# EAGLE design TestBoard3 (EAGLE 9.6.2)

## Sheet 1 of 5
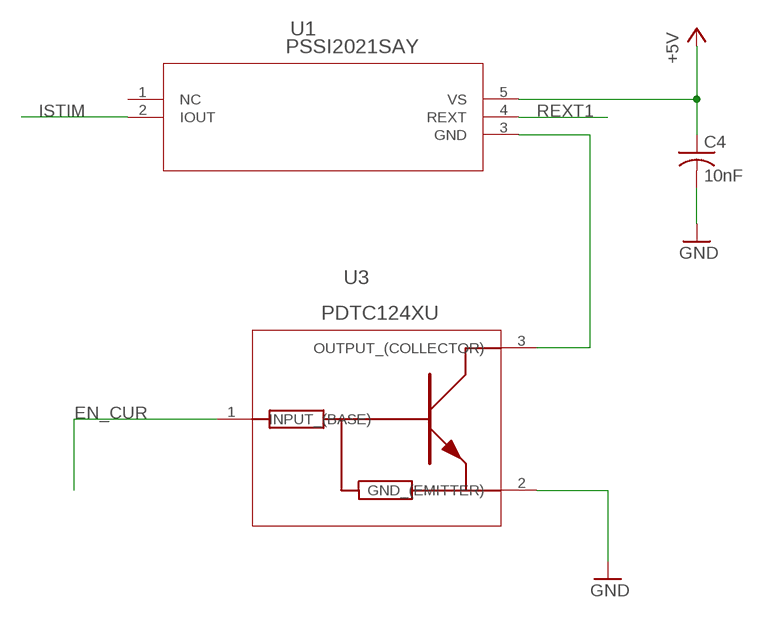
[diagram p0: schematic, sheet 1]

### Parts
C4  10nF  C-USC0603  [C0603]
U1  PSSI2021SAY  [SOT353_NXP]
U3  PDTC124XU  [SOT323_NXP]

### Nets
+5V: C4.1 U1.5(VS) ; also sheet 2,3,4
EN_CUR: U3.1(INPUT_(BASE)) ; also sheet 5
GND: C4.2 U3.2(GND_(EMITTER)) ; also sheet 2,3,4,5
ISTIM: U1.2(IOUT) ; also sheet 4
N$6: U1.3(GND) U3.3(OUTPUT_(COLLECTOR))
REXT1: U1.4(REXT) ; also sheet 3
Unconnected: U1.1(NC)

## Sheet 2 of 5: Voltage Boost Circuit
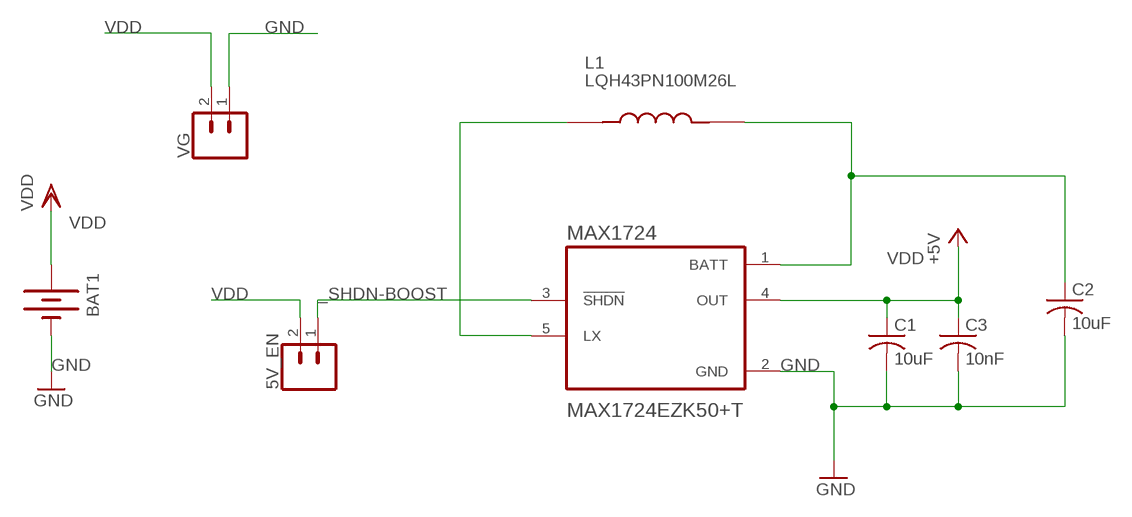
[diagram p1: schematic, sheet 2]

### Parts
5V_EN  CONN_02  [1X02]
BAT1  BATTERYBU2032SM  [BU2032SM]
C1  10uF  C-USC1206  [C1206]
C2  10uF  C-USC1206  [C1206]
C3  10nF  C-USC0603  [C0603]
L1  LQH43PN100M26L  [IND_LQH43PN100M26L]
MAX1724  MAX1724EZK50+T  [SOT95P275X110-5N]
VG  CONN_02  [1X02]

### Nets
+5V: C1.1 C3.1 MAX1724.4(OUT) ; also sheet 1,3,4
_SHDN-BOOST: 5V_EN.1 MAX1724.3(!SHDN) ; also sheet 5
GND: BAT1.P$2(-) C1.2 C2.2 C3.2 MAX1724.2(GND) VG.1 ; also sheet 1,3,4,5
N$7: L1.1 MAX1724.5(LX)
VDD: 5V_EN.2 BAT1.P$1(+) C2.1 L1.2 MAX1724.1(BATT) VG.2 ; also sheet 3,5

## Sheet 3 of 5: Digital Potentiometer
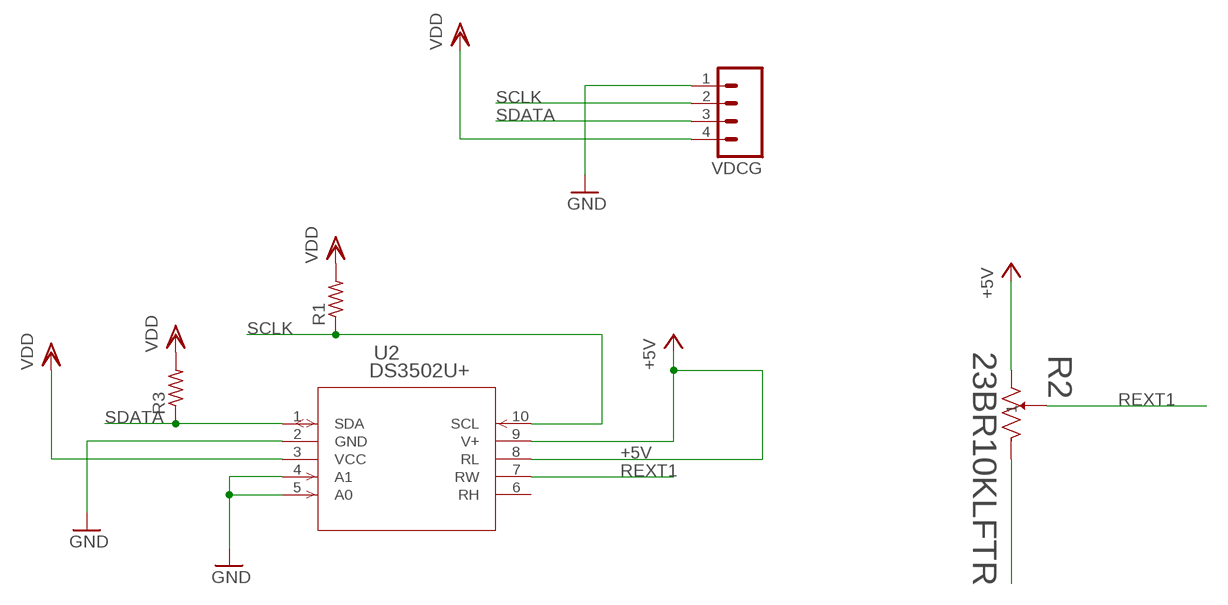
[diagram p2: schematic, sheet 3]

### Parts
R1  R-US_R0603  [R0603]
R2  23BR10KLFTR  [RES3_23B_TTE]
R3  R-US_R0603  [R0603]
U2  DS3502U+  [21-0061_U10+2_MXM]
VDCG  M04LOCK  [1X04_LOCK]

### Nets
+5V: R2.1 U2.8(RL) U2.9(V+) ; also sheet 1,2,4
GND: U2.2(GND) U2.4(A1) U2.5(A0) VDCG.1 ; also sheet 1,2,4,5
N$2: R2.3
REXT1: R2.2 U2.7(RW) ; also sheet 1
SCLK: R1.1 U2.10(SCL) VDCG.2 ; also sheet 5
SDATA: R3.1 U2.1(SDA) VDCG.3 ; also sheet 5
VDD: R1.2 R3.2 U2.3(VCC) VDCG.4 ; also sheet 2,5
Unconnected: U2.6(RH)

## Sheet 4 of 5: Electrode H-Bridge Multiplexer
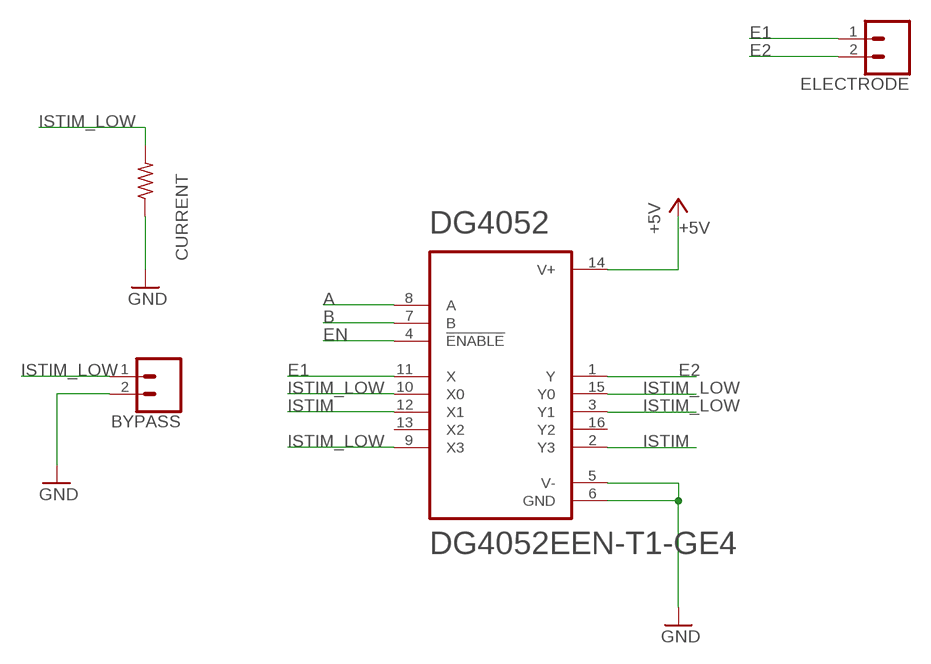
[diagram p3: schematic, sheet 4]

### Parts
BYPASS  CONN_02LOCK  [1X02_LOCK]
CURRENT  R-US_0204/7  [0204/7]
DG4052  DG4052EEN-T1-GE4  [QFN40P260X180X60-16N]
ELECTRODE  CONN_02  [1X02]

### Nets
+5V: DG4052.14(V+) ; also sheet 1,2,3
A: DG4052.8(A) ; also sheet 5
B: DG4052.7(B) ; also sheet 5
E1: DG4052.11(X) ELECTRODE.1
E2: DG4052.1(Y) ELECTRODE.2
EN: DG4052.4(!ENABLE) ; also sheet 5
GND: BYPASS.2 CURRENT.1 DG4052.5(V-) DG4052.6(GND) ; also sheet 1,2,3,5
ISTIM: DG4052.2(Y3) DG4052.12(X1) ; also sheet 1
ISTIM_LOW: BYPASS.1 CURRENT.2 DG4052.3(Y1) DG4052.9(X3) DG4052.10(X0) DG4052.15(Y0) ; also sheet 5
Unconnected: DG4052.13(X2) DG4052.16(Y2)

## Sheet 5 of 5: MSP430
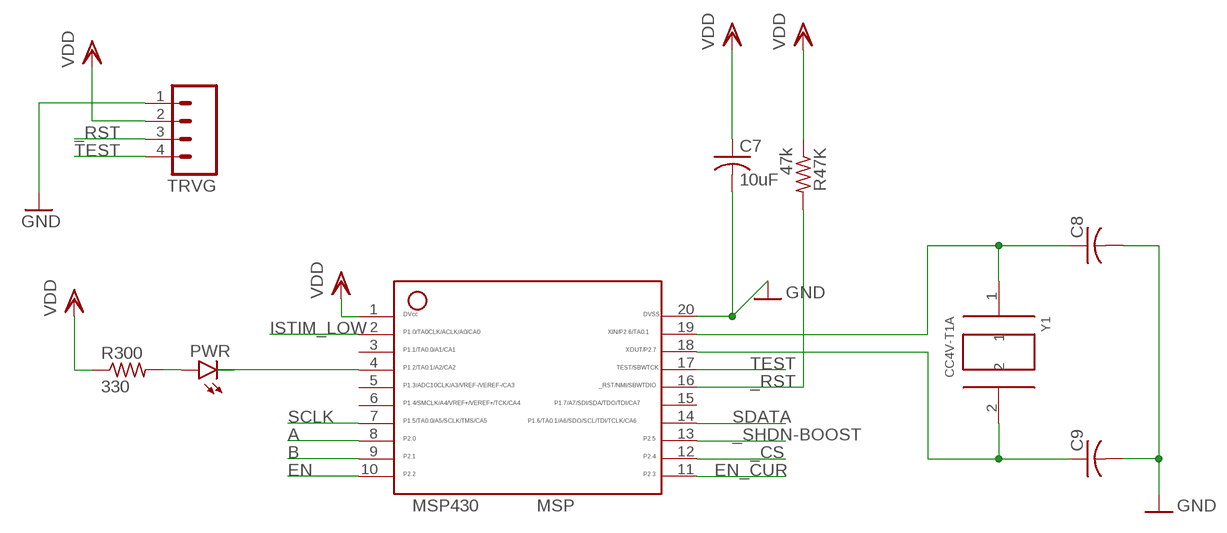
[diagram p4: schematic, sheet 5]

### Parts
C7  10uF  C-USC1206  [C1206]
C8  C-USC0603  [C0603]
C9  C-USC0603  [C0603]
MSP430  MSP  MSP430  [20_PIN]
PWR  LEDCHIPLED_0603  [CHIPLED_0603]
R47K  47k  R-US_R0603  [R0603]
R300  330  R-US_R0603  [R0603]
TRVG  M04LOCK  [1X04_LOCK]
Y1  CC4V-T1A  [CC4V-T1A]

### Nets
_CS: MSP430.12
_RST: MSP430.16 R47K.2 TRVG.3
_SHDN-BOOST: MSP430.13 ; also sheet 2
A: MSP430.8 ; also sheet 4
B: MSP430.9 ; also sheet 4
EN: MSP430.10 ; also sheet 4
EN_CUR: MSP430.11 ; also sheet 1
GND: C7.2 C8.2 C9.2 MSP430.20 TRVG.1 ; also sheet 1,2,3,4
ISTIM_LOW: MSP430.2 ; also sheet 4
N$10: MSP430.4 PWR.C
N$13: PWR.A R300.2
N$14: C8.1 MSP430.19 Y1.1
N$15: C9.1 MSP430.18 Y1.2
SCLK: MSP430.7 ; also sheet 3
SDATA: MSP430.14 ; also sheet 3
TEST: MSP430.17 TRVG.4
VDD: C7.1 MSP430.1 R47K.1 R300.1 TRVG.2 ; also sheet 2,3
Unconnected: MSP430.3 MSP430.5 MSP430.6 MSP430.15

## Library data of the parts
5V_EN BYPASS ELECTRODE VG = SparkFun-Connectors:CONN_02: Multi connection point. Often used as Generic Header-pin footprint for 0.1 inch spaced/style header connections On any of the 0.1 inch spaced packages, you can populate with these: Break Away Headers - Straight <https://www.sparkfun.com/products/116> (PRT-00116) Break Away Male Headers - Right Angle <https://www.sparkfun.com/products/553> (PRT-00553) Female Headers <https://www.sparkfun.com/products/115> (PRT-00115) Break Away Headers - Machine Pin <https://www.sparkfun.com/products/117> (PRT-00117) Break Away Female Headers - Swiss Machine Pin <https://www.sparkfun.com/products/743> (PRT-00743) For SCREWTERMINALS and SPRING TERMINALS visit here: Screw Terimnals on SparkFun.com <https://www.sparkfun.com/search/results?term=Screw+Terminals> (5mm/3.5mm/2.54mm spacing) This device is also useful as a general connection point to wire up your design to another part of your project. Our various solder wires solder well into these plated through hole pads. Hook-Up Wire - Assortment (Stranded, 22 AWG) <https://www.sparkfun.com/products/11375> (PRT-11375) Hook-Up Wire - Assortment (Solid Core, 22 AWG) <https://www.sparkfun.com/products/11367> (PRT-11367) View the entire wire category on our website here <https://www.sparkfun.com/categories/141> Special notes: Molex polarized connector foot print use with: PRT-08233 with associated crimp pins and housings. 2.54_SCREWTERM for use with PRT-10571. 3.5mm Screw Terminal footprints for PRT-08084 5mm Screw Terminal footprints for use with PRT-08432
BAT1 = ELEC327:BATTERY: Battery Holders Various common sizes : AA, AAA, 20mm coin cell and 12mm coin cell. 20MM_4LEGS, BATT-10373
C1-C4 C7-C9 = rcl:C-US: CAPACITOR, American symbol; SPICEPREFIX: C
CURRENT R1 R3 R47K R300 = rcl:R-US_: RESISTOR, American symbol; SPICEPREFIX: R
DG4052 = DG4052EEN-T1-GE4:DG4052EEN-T1-GE4: DG4052E Series 16 V 78 Ohm High Precision CMOS Analog Multiplexer - miniQFN-16; DESCRIPTION: 2 Circuit IC Switch 4:1 78Ohm 16-miniQFN (1.8x2.6); DIGI-KEY_PART_NUMBER: DG4052EEN-T1-GE4CT-ND; MF: Vishay; MP: DG4052EEN-T1-GE4; PACKAGE: WFQFN-16 Vishay; PURCHASE-URL: https://pricing.snapeda.com/search/part/DG4052EEN-T1-GE4/?ref=eda
L1 = LQH43PN100M26L:LQH43PN100M26L: Inductor Power Chip Unshielded Wirewound 10uH 10% 1MHz Ferrite 650mA 240mOhm DCR 1812 T/R; DESCRIPTION: Inductor with Inductance: 10uH Tol. +/-20%, Package: 1812 (4532); DIGI-KEY_PART_NUMBER: 490-12780-1-ND; MF: Murata; MP: LQH43PN100M26L; PACKAGE: NONSTANDARD; PURCHASE-URL: https://pricing.snapeda.com/search/part/LQH43PN100M26L/?ref=eda
MAX1724 = MAX1724EZK50_T:MAX1724EZK50+T; DESCRIPTION: Boost Switching Regulator IC Positive Fixed 5V 1 Output 400mA (Switch) SOT-23-5 Thin, TSOT-23-5; DIGI-KEY_PART_NUMBER: MAX1724EZK50+TCT-ND; MF: Maxim Integrated; MP: MAX1724EZK50+T; PACKAGE: SOT-23-5 Maxim; PURCHASE-URL: https://pricing.snapeda.com/search/part/MAX1724EZK50+T/?ref=eda
MSP430 = RatDBS:MSP430: MSP430 20 pins
PWR = led:LED: LED OSRAM: - CHIPLED LG R971, LG N971, LY N971, LG Q971, LY Q971, LO R971, LY R971 LH N974, LH R974 LS Q976, LO Q976, LY Q976 LO Q996 - Hyper CHIPLED LW Q18S LB Q993, LB Q99A, LB R99A - SideLED LS A670, LO A670, LY A670, LG A670, LP A670 LB A673, LV A673, LT A673, LW A673 LH A674 LY A675 LS A676, LA A676, LO A676, LY A676, LW A676 LS A679, LY A679, LG A679 - Hyper Micro SIDELED® LS Y876, LA Y876, LO Y876, LY Y876 LT Y87S - SmartLED LW L88C, LW L88S LB L89C, LB L89S, LG L890 LS L89K, LO L89K, LY L89K LS L896, LA L896, LO L896, LY L896 - TOPLED LS T670, LO T670, LY T670, LG T670, LP T670 LSG T670, LSP T670, LSY T670, LOP T670, LYG T670 LG T671, LOG T671, LSG T671 LB T673, LV T673, LT T673, LW T673 LH T674 LS T676, LA T676, LO T676, LY T676, LB T676, LH T676, LSB T676, LW T676 LB T67C, LV T67C, LT T67C, LS T67K, LO T67K, LY T67K, LW E67C LS E67B, LA E67B, LO E67B, LY E67B, LB E67C, LV E67C, LT E67C LW T67C LS T679, LY T679, LG T679 LS T770, LO T770, LY T770, LG T770, LP T770 LB T773, LV T773, LT T773, LW T773 LH T774 LS E675, LA E675, LY E675, LS T675 LS T776, LA T776, LO T776, LY T776, LB T776 LHGB T686 LT T68C, LB T68C - Hyper Mini TOPLED® LB M676 - Mini TOPLED Santana® LG M470 LS M47K, LO M47K, LY M47K Source: http://www.osram.convergy.de LUXEON: - LUMILED® LXK2-PW12-R00, LXK2-PW12-S00, LXK2-PW14-U00, LXK2-PW14-V00 LXK2-PM12-R00, LXK2-PM12-S00, LXK2-PM14-U00 LXK2-PE12-Q00, LXK2-PE12-R00, LXK2-PE12-S00, LXK2-PE14-T00, LXK2-PE14-U00 LXK2-PB12-K00, LXK2-PB12-L00, LXK2-PB12-M00, LXK2-PB14-N00, LXK2-PB14-P00, LXK2-PB14-Q00 LXK2-PR12-L00, LXK2-PR12-M00, LXK2-PR14-Q00, LXK2-PR14-R00 LXK2-PD12-Q00, LXK2-PD12-R00, LXK2-PD12-S00 LXK2-PH12-R00, LXK2-PH12-S00 LXK2-PL12-P00, LXK2-PL12-Q00, LXK2-PL12-R00 Source: www.luxeon.com KINGBRIGHT: KA-3528ASYC Source: www.kingbright.com
R2 = trimmer:23BR10KLFTR; COPYRIGHT: Copyright (C) 2016 Accelerated Designs. All rights reserved; MANUFACTURER_PART_NUMBER: 23BR10KLFTR; SOURCELIBRARY: TTELECTRONICS_2018-04-11; VENDOR: TT Electronics
TRVG VDCG = Pendant:M04: Header 4 Standard 4-pin 0.1" header. Use with straight break away headers (SKU : PRT-00116), right angle break away headers (PRT-00553), swiss pins (PRT-00743), machine pins (PRT-00117), and female headers (PRT-00115). Molex polarized connector foot print use with SKU : PRT-08231 with associated crimp pins and housings.
U1 = PSSI2021SAY:PSSI2021SAY; COPYRIGHT: Copyright (C) 2021 Ultra Librarian. All rights reserved.; DIGI-KEY_PART_NUMBER_1: 568-5037-2-ND; DIGI-KEY_PART_NUMBER_2: 568-5037-1-ND; DIGI-KEY_PART_NUMBER_3: 568-5037-6-ND; MANUFACTURER_PART_NUMBER: PSSI2021SAY; MFR_NAME: NXP
U2 = DS3502U+:DS3502U+; COPYRIGHT: Copyright (C) 2022 Ultra Librarian. All rights reserved.; DIGI-KEY_PART_NUMBER_1: DS3502U+-ND; MANUFACTURER_PART_NUMBER: ds3502u+; MFR_NAME: Maxim Integrated Products
U3 = PDTC124XU:PDTC124XU; COPYRIGHT: Copyright (C) 2021 Ultra Librarian. All rights reserved.; DIGI-KEY_PART_NUMBER_1: 568-11253-1-ND; DIGI-KEY_PART_NUMBER_2: 568-11253-6-ND; DIGI-KEY_PART_NUMBER_3: 568-11253-2-ND; MANUFACTURER_PART_NUMBER: PDTC124XU; MFR_NAME: NXP
Y1 = CC4V-T1A-32.768KHZ-7PF-20PPM:CC4V-T1A: Microcrystal CC4V-T1A Low Frequency Tuning Fork Crystal; AVAILABILITY: In Stock; DESCRIPTION: 32.768kHz ±20ppm Crystal 6pF 50 kOhms 2-SMD, No Lead; MF: Micro Crystal AG; MP: CC4V-T1A-32.768KHZ-7PF-20PPM; PACKAGE: SMD-2; PRICE: None; PURCHASE-URL: https://www.digikey.com/en/products/detail/micro-crystal-ag/CC4V-T1A-32-768KHZ-7PF-20PPM-TA-QC/10499071

## Board
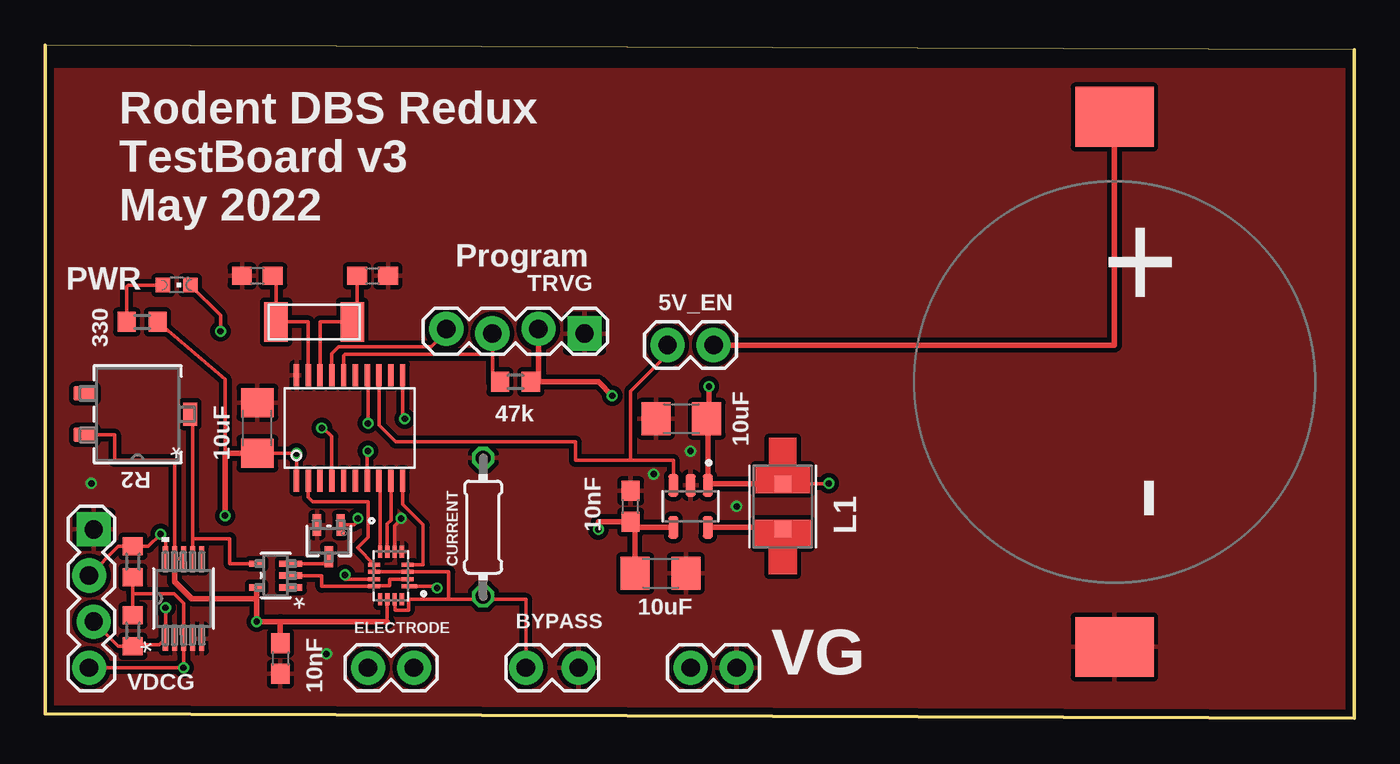
[diagram p5: board, top side]
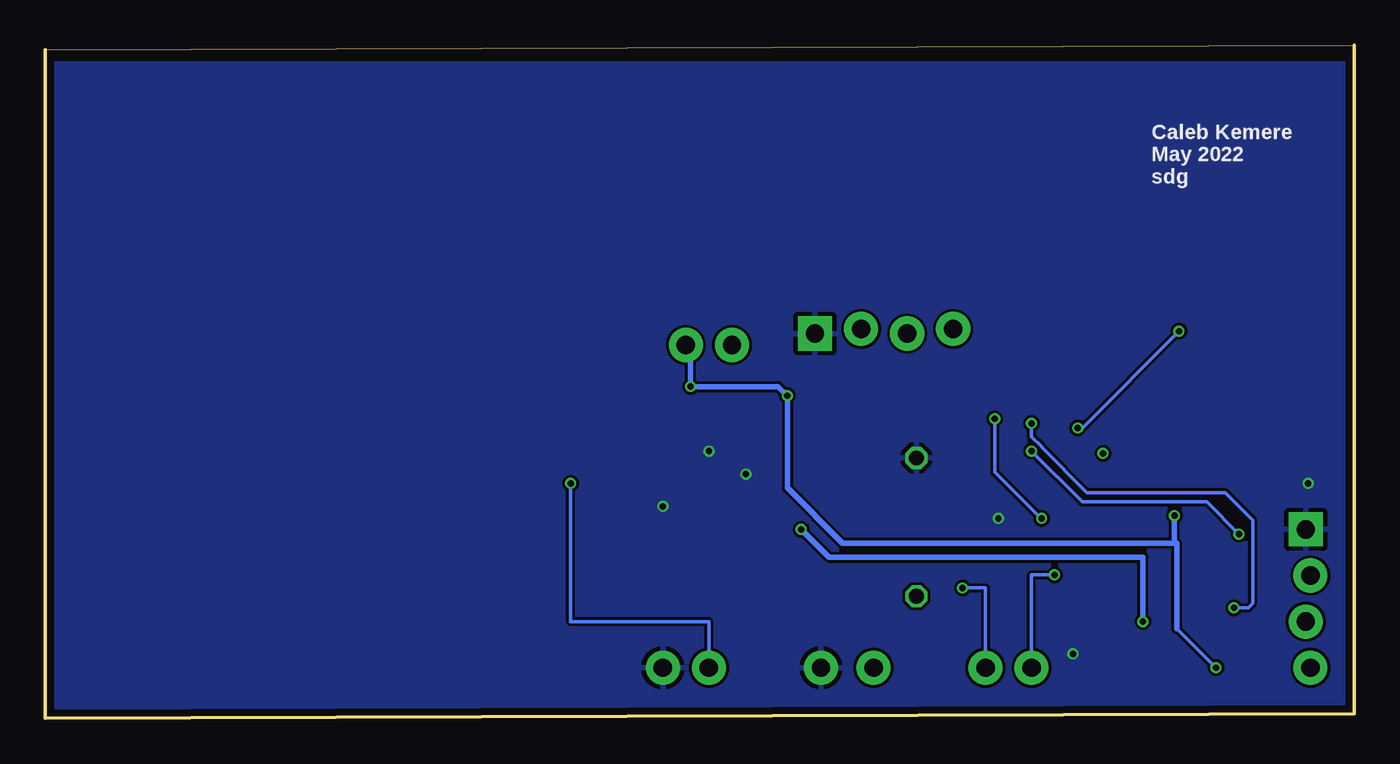
[diagram p6: board, bottom side, seen from below]

Size 72.14 x 37.08 mm. Coordinates in mm from the lower left corner, seen from the top.
Outline: 0,37.08 0,0.25 72.14,0 72.14,36.83 0,37.08
Copper layers (1*16): Top 0.035559375mm / dielectric 1.6mm / Bottom 0.035559375mm
Design rules "oshpark-2layer": minimum track width 6mil, minimum drill 10mil, track to track 6mil, track to pad 6mil, pad to pad 6mil, via to via 6mil, smd to smd 6mil, copper to edge 15mil, drill to drill 6mil, minimum pad ring 5mil, minimum via ring 5mil, stop-mask expansion 2.5mil, vias tented up to drill 0mil, thermal gap 10mil

### Footprints (pad centres in the part's own frame; a part is rotated, then mirrored left to right if it is on the bottom)
1X02 = drill 1.016 pad 1.88: 1 0,0; 2 2.54,0
BU2032SM = smd 3.302 x 4.318: P$1 -14.605,0; P$2 14.605,0
1X02_LOCK = drill 1.016 pad 1.88: 1 -0.178,0; 2 2.718,0
C1206 = smd 1.6 x 1.8: 1 -1.4,0; 2 1.4,0
C0603 = smd 1.1 x 1: 1 -0.85,0; 2 0.85,0
0204/7 = drill 0.813 octagon: 1 -3.81,0; 2 3.81,0
QFN40P260X180X60-16N = smd 0.863 x 0.225: 1 -1.018,0.6 | smd 0.663 x 0.225: 2 -0.918,0.2; 3 -0.918,-0.2; 4 -0.918,-0.6; 9 0.918,-0.6; 10 0.918,-0.2; 11 0.918,0.2; 12 0.918,0.6 | smd 0.225 x 0.663: 5 -0.6,-1.319; 6 -0.2,-1.319; 7 0.2,-1.319; 8 0.6,-1.319; 13 0.6,1.319; 14 0.2,1.319; 15 -0.2,1.319; 16 -0.6,1.319
IND_LQH43PN100M26L = smd 0.9 x 0.9: 1 -1.25,0; 2 1.25,0
SOT95P275X110-5N = smd 1.24 x 0.55: 1 -1.16,0.95; 2 -1.16,0; 3 -1.16,-0.95; 4 1.16,-0.95; 5 1.16,0.95
20_PIN = smd 0.3 x 1.2: 1 -2.925,-2.9; 2 -2.275,-2.9; 3 -1.625,-2.9; 4 -0.975,-2.9; 5 -0.325,-2.9; 6 0.325,-2.9; 7 0.975,-2.9; 8 1.625,-2.9; 9 2.275,-2.9; 10 2.925,-2.9; 11 2.925,2.9; 12 2.275,2.9; 13 1.625,2.9; 14 0.975,2.9; 15 0.325,2.9; 16 -0.325,2.9; 17 -0.975,2.9; 18 -1.625,2.9; 19 -2.275,2.9; 20 -2.925,2.9
CHIPLED_0603 = smd 0.8 x 0.8: A 0,-0.75; C 0,0.75
R0603 = smd 1 x 1.1: 1 -0.85,0; 2 0.85,0
RES3_23B_TTE = smd 1.27 x 0.813: 1 2.896,1.143; 3 2.896,-1.143 | smd 0.762 x 1.27: 2 -2.896,0
1X04_LOCK = drill 1.016 pad 1.88 square: 1 0,0.127 | drill 1.016 pad 1.88: 2 2.54,-0.127; 3 5.08,0.127; 4 7.62,-0.127
SOT353_NXP = smd 1.27 x 0.356: 1 -0.826,0.65; 2 -0.826,0; 3 -0.826,-0.65 | smd 0.813 x 0.356: 4 1.054,-0.65; 5 1.054,0.65
21-0061_U10+2_MXM = smd 1.359 x 0.279: 1 -2.203,1; 2 -2.203,0.5; 3 -2.203,0; 4 -2.203,-0.5; 5 -2.203,-1; 6 2.203,-1; 7 2.203,-0.5; 8 2.203,0; 9 2.203,0.5; 10 2.203,1
SOT323_NXP = smd 0.457 x 1.168: 1 -0.65,-0.876; 2 0.65,-0.876; 3 0,0.876
CC4V-T1A = smd 1.3 x 2.2: 1 -2.1,0; 2 2.1,0

### Placement (x,y rotation side)
5V_EN  34.29,20.57 0 top
BAT1  58.93,18.54 270 top
BYPASS  26.67,2.79 0 top
C1  33.91,8 0 top
C2  35.05,16.51 180 top
C3  32.26,11.68 90 top
C4  12.95,3.3 270 top
C7  11.68,16 90 top
C8  11.68,24.38 180 top
C9  18.03,24.38 0 top
CURRENT  24.13,10.54 270 top
DG4052  19.05,7.87 180 top
ELECTRODE  17.78,2.79 0 top
L1  40.64,11.68 90 top
MAX1724  35.56,11.68 270 top
MSP430  16.76,16 0 top
PWR  7.24,23.88 270 top
R1  4.83,8.64 270 top
R2  5.08,16.76 180 top
R3  4.83,4.83 90 top
R47K  25.91,18.54 180 top
R300  5.33,21.84 180 top
TRVG  29.72,21.34 180 top
U1  12.7,7.87 180 top
U2  7.62,6.6 90 top
U3  15.62,9.78 180 top
VDCG  2.54,10.41 270 top
VG  38.1,2.79 180 top
Y1  14.81,21.84 0 top

### Tracks (layer width: path | path; a pad name or v marks a point on that pad's centre or on a via)
+5V  (via drill 0.35)
  Top 0.203: 18.85,5.33 DG4052.14 | U2.8 U2.9 7.12,14.22 3.81,14.22 3.81,15.62 R2.1
  Top 0.305: U1.5 11.65,6.6 | 11.65,6.6 v11.65,5.33 | v11.65,5.33 18.85,5.33 | 11.65,6.6 8.05,6.6 7.12,7.54 U2.9 | v11.65,5.33 12.95,5.33 C4.1 | MAX1724.4 32.51,10.52 | 32.51,10.52 32.26,10.52 C3.1 30.48,10.83 v30.48,10.41 | C1.1 32.51,10.52
  Bottom 0.305: v11.65,5.33 11.65,8.89 28.96,8.89 v30.48,10.41
_RST
  Top 0.203: R47K.2 24.64,18.54 24.64,20.07 | 24.64,20.07 TRVG.3 | MSP430.16 16.44,20 16.51,20.07 24.64,20.07
_SHDN-BOOST
  Top 0.203: MAX1724.3 34.61,14.22 32.26,14.22 | 32.26,14.22 29.21,14.22 29.21,15.24 19.3,15.24 18.39,16.16 MSP430.13 | 5V_EN.1 34.29,20.07 32.26,18.03 32.26,14.22
A
  Top 0.203: DG4052.8 18.45,13.04 MSP430.8
B
  Top 0.203: DG4052.7 18.85,10.72 19.05,10.92 19.05,13.09 MSP430.9
E1  (via drill 0.35)
  Top 0.203: DG4052.11 16.51,7.67 v16.51,7.91
  Bottom 0.203: v16.51,7.91 17.78,7.91 ELECTRODE.1
E2  (via drill 0.35)
  Top 0.203: DG4052.1 21.59,7.27 v21.59,7.19
  Bottom 0.203: v21.59,7.19 20.32,7.19 ELECTRODE.2
EN
  Top 0.203: DG4052.4 20.83,8.47 20.83,10.67 19.69,11.81 MSP430.10
EN_CUR  (via drill 0.35)
  Top 0.203: MSP430.11 19.69,16.63 v19.81,16.51 | U3.1 16.28,10.67 17.02,10.67 17.22,10.87 v17.22,11.02
  Bottom 0.203: v19.81,16.51 19.81,13.56 17.27,11.02 v17.22,11.02
GND  (via drill 0.35)
  Top 0.203: v19.61,11.02 19.61,10.97 19.25,10.61 DG4052.6
  other vias: 38.1,11.68 2.54,12.95 15.49,3.56 33.53,13.46 35.56,14.73
  pour Top (isolate 0.254): 0,0.25 0,35.81 71.88,35.81 71.88,0.25
  pour Bottom: 0,0.25 0,36.07 71.88,36.07 71.88,0.25
ISTIM
  Top 0.203: DG4052.2 18.97,7.67 18.97,7.31 18.13,7.31 DG4052.12 15.24,7.27 15.24,7.87 U1.2
ISTIM_LOW
  Top 0.203: 22.23,6.55 22.23,8.07 DG4052.3 DG4052.10 DG4052.9 17.21,9.4 17.78,9.97 17.78,11.94 14.73,11.94 14.49,12.18 MSP430.2 | DG4052.15 19.28,6.55 19.28,5.97 20.02,5.97 20.02,6.55 22.23,6.55 | CURRENT.2 24.13,6.55 | BYPASS.1 26.49,6.55 24.13,6.55 | 22.23,6.55 24.13,6.55
N$6
  Top 0.203: U3.3 15.62,8.52 U1.3
N$7
  Top 0.305: MAX1724.5 40.64,10.52 L1.1
N$10  (via drill 0.35)
  Top 0.203: MSP430.4 15.79,15.54 15.32,16 v15.24,16 | PWR.C 9.65,22.21 v9.65,21.34
  Bottom 0.203: v9.65,21.34 14.99,16 v15.24,16
N$13
  Top 0.203: PWR.A 4.57,23.88 4.48,23.79 R300.2
N$14
  Top 0.203: MSP430.19 14.49,21.84 Y1.1 12.71,24.38 C8.1
N$15
  Top 0.203: MSP430.18 15.14,21.84 Y1.2 17.18,21.84 C9.1
REXT1
  Top 0.203: U1.4 10.16,8.52 10.16,9.91 8.12,9.91 | U2.7 8.12,9.91 | 8.12,9.91 8.12,10.41 8.12,16.76
  Top 0.305: 8.12,16.76 R2.2
SCLK  (via drill 0.35)
  Top 0.203: U2.10 6.62,9.89 v6.35,10.16 5.68,9.49 R1.1 4.03,9.49 VDCG.2 | MSP430.7 17.74,14.69 v17.78,14.73
  Bottom 0.203: v6.35,10.16 8.13,11.94 14.99,11.94 v17.78,14.73
SDATA  (via drill 0.35)
  Top 0.203: v6.62,6.1 U2.1 6.28,4.06 4.91,4.06 R3.1 4.03,3.98 VDCG.3 | v17.78,16.26 17.78,18.76 17.74,18.8
  Top 0.305: 17.74,18.8 MSP430.14
  Bottom 0.203: v6.62,6.1 5.84,6.1 5.59,6.35 5.59,10.92 7.11,12.45 14.73,12.45 17.22,14.94 17.22,14.96 17.78,15.52 v17.78,16.26
TEST
  Top 0.203: MSP430.17 15.79,20.11 16.17,20.49 21.25,20.49 22.1,21.34 TRVG.4
VDD  (via drill 0.35)
  Top 0.203: VDCG.4 v7.62,2.79 U2.3 7.62,6.35 7.11,6.86 4.83,6.86 | C7.1 v13.84,14.6 MSP430.1 | v43.18,12.95 43.18,12.93 L1.2 | R300.1 9.91,18.69 9.91,14.6 | 4.83,6.86 R3.2 | 4.83,6.86 R1.2
  Top 0.305: L1.2 36.51,12.93 MAX1724.1 36.51,16.51 C2.1 36.58,16.63 v36.58,18.29 | BAT1.P$1 58.93,20.57 5V_EN.2 | v9.91,11.18 9.91,14.6 C7.1 | v31.24,17.78 30.48,18.54 R47K.1 27.18,18.69 TRVG.2
  Bottom 0.203: v7.62,2.79 9.78,4.95 | VG.2 35.56,5.33 43.18,5.33 v43.18,12.95
  Bottom 0.305: 9.78,4.95 9.78,9.65 9.91,9.65 | 9.91,9.65 28.19,9.65 31.24,12.7 v31.24,17.78 31.75,18.29 v36.58,18.29 36.58,20.32 5V_EN.2 | 9.91,9.65 v9.91,11.18

### Text on the board
tPlace: Rodent DBS Redux / TestBoard v3 / May 2022 | Program
bPlace: Caleb Kemere / May 2022 / sdg